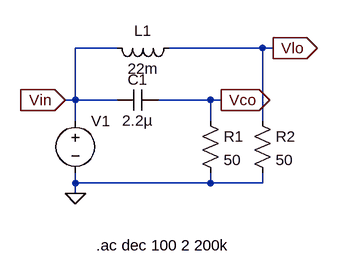
[diagram p0: schematic Frequency.asc]
Frequency.asc, the LTspice schematic file:
Version 4
SHEET 1 880 680
WIRE 304 192 240 192
WIRE 528 192 384 192
WIRE 544 192 528 192
WIRE 240 272 240 192
WIRE 240 272 224 272
WIRE 304 272 240 272
WIRE 448 272 368 272
WIRE 464 272 448 272
WIRE 240 304 240 272
WIRE 448 304 448 272
WIRE 528 304 528 192
WIRE 240 400 240 384
WIRE 448 400 448 384
WIRE 448 400 240 400
WIRE 528 400 528 384
WIRE 528 400 448 400
WIRE 240 416 240 400
FLAG 240 416 0
FLAG 224 272 Vin
IOPIN 224 272 In
FLAG 464 272 Vco
IOPIN 464 272 Out
FLAG 544 192 Vlo
IOPIN 544 192 Out
SYMBOL voltage 240 288 R0
WINDOW 3 24 96 Invisible 2
SYMATTR InstName V1
SYMATTR Value SINE()
SYMATTR Value2 AC 3
SYMBOL ind 400 176 R90
WINDOW 0 5 56 VBottom 2
WINDOW 3 32 56 VTop 2
SYMATTR InstName L1
SYMATTR Value 22m
SYMATTR SpiceLine Ipk=190m Rser=14.448 Rpar=2.0724Meg Cpar=0 mfg="Coilcraft" pn="PCH-45X-226"
SYMBOL cap 368 256 R90
WINDOW 0 0 32 VBottom 2
WINDOW 3 32 32 VTop 2
SYMATTR InstName C1
SYMATTR Value 2.2µ
SYMBOL res 432 288 R0
WINDOW 0 36 40 Left 2
WINDOW 3 36 76 Left 2
SYMATTR InstName R1
SYMATTR Value 50
SYMBOL res 512 288 R0
WINDOW 0 36 40 Left 2
WINDOW 3 36 76 Left 2
SYMATTR InstName R2
SYMATTR Value 50
TEXT 272 496 Left 2 !.ac dec 100 2 200k

The netlist it stands for:
* Frequency.asc
V1 Vin 0 SINE() AC 3
L1 Vlo Vin 22m Ipk=190m Rser=14.448 Rpar=2.0724Meg Cpar=0 mfg="Coilcraft" pn="PCH-45X-226"
C1 Vco Vin 2.2µ
R1 Vco 0 50
R2 Vlo 0 50
.ac dec 100 2 200k
.backanno
.end